# EasyEDA Pro project 2025_09_11_usb2spi.epro

# Board PCB1
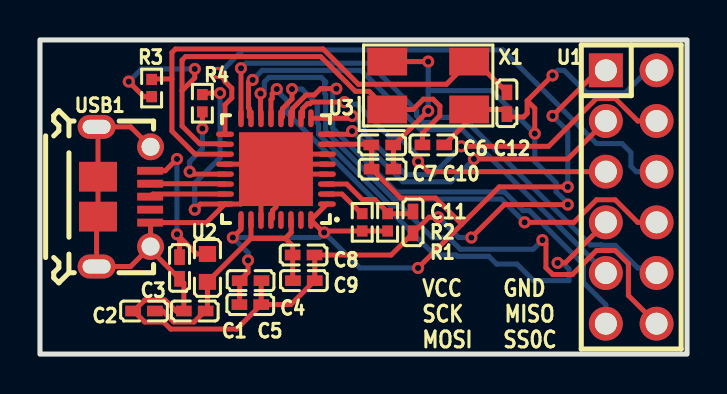
[diagram p0: board, top side]
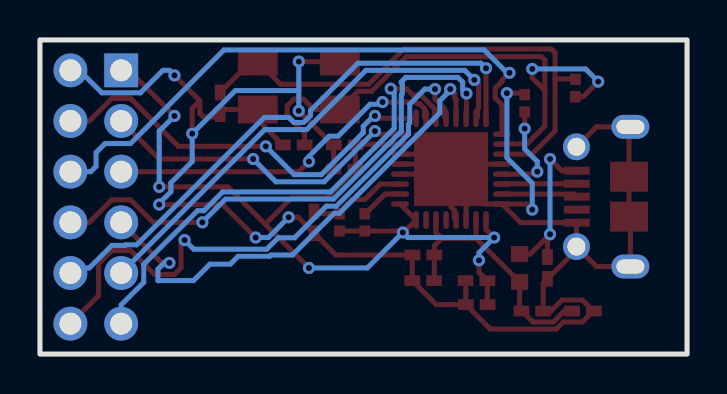
[diagram p1: board, bottom side, seen from below]

Outline 32.38 x 15.75 mm; copper layers: Top Layer, Bottom Layer. Coordinates in mm from the lower left corner of the outline.
Outline path: rectangle 0,15.75 32.38,0
Stack: Top Layer 0.035mm / Dielectric1 1.51mm FR4 er 4.5 / Bottom Layer 0.035mm

## Design rules (mm)
template: JLCPCB Capability(Two Layers Board)
spacing copperThickness1oz (default): track to track 0.102, other pairs 0.152 to 0.3
spacing copperThickness2oz: track to track 0.203, other pairs 0.152 to 0.3
track width copperThickness1oz (default): min 0.127, default 0.254, max 2.54
track width copperThickness2oz: min 0.203, default 0.254, max 2.54
differential pair differentialPair (default): width min 0.127, default 0.254, max 2.54; gap min 0.152, default 0.152
via viaSize (default): diameter min 0.5, default 0.61, max 10; hole min 0.3, default 0.305, max 6.3

## Placement (name value [footprint] x y rotation side)
C1  100nF  [C0402]  7.75 2.16 180 top
C2  4.7uF  [C0402]  5.21 2.16 0 top
C3  10nF  [C0402]  6.99 4.32 90 top
C4  100nF  [C0402]  10.54 3.68 0 top
C5  4.7uF  [C0402]  10.53 2.48 180 top
C6  100nF  [C0402]  17.13 10.48 0 top
C7  4.7uF  [C0402]  17.15 9.27 180 top
C8  100nF  [C0402]  13.19 4.97 0 top
C9  4.7uF  [C0402]  13.21 3.68 180 top
C10  30pF  [C0402]  19.69 10.48 180 top
C11  470nF  [C0402]  18.67 6.6 90 top
C12  30pF  [C0402]  23.37 12.57 90 top
R1  10kΩ  [R0402]  16.13 6.6 90 top
R2  47kΩ  [R0402]  17.4 6.6 90 top
R3  1MΩ  [R0402]  5.59 13.34 90 top
R4  12kΩ  [R0402]  8.13 12.57 270 top
U1  ZX-PZ2.54-2-6PZZ  [HDR-TH_12P-P2.54-V-M-R2-C6-S2.54]  29.59 7.87 270 top
U2  CBW160808U400T  [L0603]  8.38 4.32 270 top
U3  FT4222HQ-D-T  [QFN-32_L5.0-W5.0-P0.50-BL-EP3.7]  11.81 9.27 90 top
USB1  1050170001  [MICRO-USB-SMD_105017-0001]  4.19 7.89 270 top
X1  12MHz  [OSC-SMD_4P-L5.0-W3.2-BL]  19.43 13.46 0 top

## Footprints (pads in the part's own frame, mm; a bottom-side part is the same pattern mirrored in y, then rotated)
C0402
  rect 0.79x0.54 smd: 1(-0.545,0) 2(0.545,0)
HDR-TH_12P-P2.54-V-M-R2-C6-S2.54
  rect 1.7x1.7 hole 1.1: 1(-6.35,-1.27)
  round 1.7 hole 1.1: 2(-6.35,1.27) 3(-3.81,-1.27) 4(-3.81,1.27) 5(-1.27,-1.27) 6(-1.27,1.27) 7(1.27,-1.27) 8(1.27,1.27) 9(3.81,-1.27) 10(3.81,1.27) 11(6.35,-1.27) 12(6.35,1.27)
L0603
  rect 0.8x0.864 smd: 1(-0.7,0) 2(0.7,0)
MICRO-USB-SMD_105017-0001
  rect 0.4x1.3 smd: 1(-1.3,1.33) 2(-0.65,1.33) 3(0,1.33) 4(0.65,1.33) 5(1.3,1.33)
  round 1.35 hole 0.9: 6(-2.5,1.35) 7(2.5,1.35)
  oval 1.2x1.9 hole 0.7x1.4: 8(3.5,-1.35) 9(-3.5,-1.35)
  rect 1.5x1.9 smd: 10(-1,-1.28) 10(1,-1.28)
OSC-SMD_4P-L5.0-W3.2-BL
  rect 2x1.4 smd: 1(-2.05,-1.2) 2(2.05,-1.2) 3(2.05,1.2) 4(-2.05,1.2)
QFN-32_L5.0-W5.0-P0.50-BL-EP3.7
  oval 0.28x0.9 smd: 1(-1.75,-2.55) 2(-1.25,-2.55) 3(-0.75,-2.55) 4(-0.25,-2.55) 5(0.25,-2.55) 6(0.75,-2.55) 7(1.25,-2.55) 8(1.75,-2.55) 17(1.75,2.55) 18(1.25,2.55) 19(0.75,2.55) 20(0.25,2.55) 21(-0.25,2.55) 22(-0.75,2.55) 23(-1.25,2.55) 24(-1.75,2.55)
  oval 0.9x0.28 smd: 9(2.55,-1.75) 10(2.55,-1.25) 11(2.55,-0.75) 12(2.55,-0.25) 13(2.55,0.25) 14(2.55,0.75) 15(2.55,1.25) 16(2.55,1.75) 25(-2.55,1.75) 26(-2.55,1.25) 27(-2.55,0.75) 28(-2.55,0.25) 29(-2.55,-0.25) 30(-2.55,-0.75) 31(-2.55,-1.25) 32(-2.55,-1.75)
  rect 3.7x3.7 smd: 33(0,0)
R0402
  rect 0.566x0.54 smd: 1(-0.433,0) 2(0.433,0)

## Nets
+5V: C1.1 C2.2 C8.1 C9.2 U2.2 U3.26 U3.30
GND: C1.2 C2.1 C3.1 C4.2 C5.1 C6.2 C7.1 C8.2 C9.1 C10.1 C11.1 C12.1 R4.1 U1.2 U3.4 U3.5 U3.6 U3.20 U3.24 U3.27 U3.28 U3.33 USB1.5 USB1.6 USB1.7 USB1.8 USB1.9 USB1.10 X1.2 X1.4
VCC: C4.1 C5.2 C6.1 C7.2 R1.1 R2.1 U1.1 U3.1 U3.7 U3.25 U3.32
DN: U3.22 USB1.2
DP: U3.23 USB1.3
GPIO0: U1.7 U3.13
GPIO1: U1.8 U3.14
GPIO2: U1.9 U3.15
GPIO3: U1.10 U3.16
IO2: U1.11 U3.11
IO3: U1.12 U3.12
MISO: U1.4 U3.9
MOSI: U1.5 U3.10
RESETN: C11.2 R2.2 U3.3
SCK: U1.3 U3.8
SS0C: U1.6 U3.17
STEST_RSTN: R1.2 U3.2
XSCI: C10.2 R3.1 U3.18 X1.1
XSCO: C12.2 R3.2 U3.19 X1.3
$1N566: R4.2 U3.21
$1N1266: C3.2 U2.1 USB1.1

Pads without a net: U3 29 31; USB1 4

## Via types
v1: diameter 0.61, hole 0.305, Top Layer to Bottom Layer, 37 vias

## Routing (per net, layer and track width the routed paths; a pad name or vN(x,y) marks a point on that pad's centre or on a via; arc(x,y) is an arc through that point)
+5V: length 13.5
  Top Layer w0.254: C9.2 12.65,3.7 C8.1 12.65,5.42 12.27,5.8 ; 12.27,5.8 10.56,5.8 ; 12.27,5.8 12.57,6.1 12.57,6.71 U3.30 ; 10.56,5.8 U2.2 8.38,2.25 C1.1 8.26,2.16 7.71,1.61 6.69,1.61 6.14,2.16 C2.2 ; 10.56,5.8 U3.26
GND: length 113.3
  Top Layer w0.254: USB1.7 4.53,4.39 USB1.8 2.84,6.82 USB1.10 USB1.10 2.91,11.32 USB1.9 4.53,11.39 USB1.6 ; USB1.7 5.53,6.57 USB1.5 8.33,6.59 U3.24 ; USB1.7 5.53,5.22 C3.1 7.2,3.56 C1.2 6.81,2.16 6.26,2.71 5.24,2.71 4.69,2.16 ; v1(19.94,6.86) 19.47,6.86 C11.1 17.58,4.97 C8.2 13.75,4.95 C9.1 12.55,2.48 C5.1 ; v1(26.42,7.49) 23.24,7.49 v1(21.59,5.84) ; 4.69,2.16 5.24,1.61 6.19,1.61 6.54,1.25 9.84,1.25 C5.1 ; 4.69,2.16 C2.1 ; 14.36,9.02 12.06,9.02 U3.33 ; C4.2 11.07,3.67 C5.1 ; U3.20 11.56,9.52 U3.33 ; X1.4 v1(19.43,14.66) ; U3.24 8.03,7.52 v1(7.75,7.24) ; U3.24 10.06,7.52 11.06,8.52 U3.27 ; U3.33 11.81,7.37 11.64,7.2 11.64,6.8 U3.28 ; v1(19.43,12.19) 17.72,10.48 17.68,10.48 17.69,10.47 C7.1 ; 14.36,10.02 12.56,10.02 12.06,9.52 14.36,9.52 ; v1(9.02,13.08) 8.2,13.08 R4.1 ; C10.1 21.48,11.74 21.48,12.26 23.13,12.26 C12.1 23.51,11.89 24.2,11.89 24.38,12.06 24.38,12.7 ; v1(24.76,11.05) 24.76,12.32 24.38,12.7 ; 24.38,12.7 v1(25.65,13.97)
  Bottom Layer w0.254: v1(9.02,13.08) 9.02,9.84 7.75,8.57 v1(7.75,7.24) ; v1(21.59,5.84) 20.96,5.84 v1(19.94,6.86) ; 19.43,13.21 v1(19.43,12.19) ; 19.43,13.21 22.61,13.21 v1(24.76,11.05) 24.76,9.65 25.83,8.59 25.83,8.14 26.42,7.56 v1(26.42,7.49) ; 19.43,13.21 v1(19.43,14.66) ; 30.86,14.22 30.42,14.22 29.29,13.09 27.36,13.09 26.23,14.22 25.91,14.22 v1(25.65,13.97)
VCC: length 46.1
  Top Layer w0.254: 21.1,6.5 21.1,6.52 19.8,7.82 18.05,7.82 C7.2 16.6,10.47 C6.1 16.55,10.52 14.36,10.52 ; 21.1,6.5 v1(18.92,4.32) ; 21.1,6.5 22.99,8.38 v1(26.42,8.38) ; 9.98,2.48 10,2.5 C4.1 10.41,4.1 v1(10.41,4.7) ; U3.25 10.06,6.25 v1(9.65,5.84) ; 17.4,6.17 14.3,6.17 v1(14.22,6.1) 14.19,6.1 U3.32 14.36,7.52 ; v1(25.65,11.94) 27.94,14.22 U1.1
  Bottom Layer w0.254: v1(10.41,4.7) 10.41,5.08 v1(9.65,5.84) 13.97,5.84 v1(14.22,6.1) 16,4.32 v1(18.92,4.32) ; v1(25.65,11.94) 26.42,11.18 v1(26.42,8.38)
DN: length 3.8
  Top Layer w0.254: USB1.2 9.24,8.54 U3.22
DP: length 3.8
  Top Layer w0.254: U3.23 5.65,8.02 USB1.3
GPIO0: length 25.2
  Top Layer w0.254: v1(11.85,13.28) 11.62,13.06 11.62,12.82 11.56,12.76 U3.13 ; U1.7 26.29,4.57 v1(25.91,4.57)
  Bottom Layer w0.254: v1(25.91,4.57) 25.97,4.64 26.1,4.64 26.48,4.25 26.48,3.68 24.7,3.68 23.88,4.51 22.86,4.51 22.47,4.9 20.89,4.9 20.82,4.97 19.75,4.97 17.65,7.06 17.4,7.06 12.37,12.09 12.37,12.7 12.03,13.04 12.03,13.11 v1(11.85,13.28)
GPIO1: length 27.1
  Top Layer w0.254: v1(11.04,13.06) 11.04,11.84 U3.14 ; 30.86,6.6 29.92,6.6 28.79,7.73 27.85,7.73 26.72,6.6 v1(24.26,6.6)
  Bottom Layer w0.254: v1(24.26,6.6) 24.26,6.61 23.09,7.77 17.7,7.77 14.3,11.17 14.3,13.01 14.25,13.06 14.25,13.54 14.3,13.6 14.3,13.64 14.08,13.87 11.46,13.87 11.23,13.63 11.23,13.25 v1(11.04,13.06)
GPIO2: length 24.2
  Top Layer w0.254: v1(10.65,13.74) 10.55,13.74 10.43,13.63 10.43,12.35 10.48,12.3 10.48,11.9 U3.15
  Bottom Layer w0.254: U1.9 21.13,11.25 19.04,11.25 16.07,14.22 11.13,14.22 v1(10.65,13.74)
GPIO3: length 28.1
  Top Layer w0.254: U3.16 v1(10.06,14.33)
  Bottom Layer w0.254: v1(10.06,14.33) 10.31,14.58 16.47,14.58 18.85,12.2 18.85,11.95 19.19,11.61 19.67,11.61 19.93,11.86 21.16,11.86 27.54,5.48 28.11,5.48 28.14,5.45 28.79,5.45 29.92,4.32 30.61,4.32 30.86,4.06
IO2: length 24
  Top Layer w0.254: v1(14.83,13.3) 14.04,13.3 13.73,12.99 13.32,12.99 12.64,12.31 12.64,11.9 U3.11
  Bottom Layer w0.254: U1.11 28.32,2.47 27.19,3.6 27.19,4.5 24.5,7.19 24.18,7.19 23.24,8.13 17.84,8.13 14.66,11.31 14.66,13.13 v1(14.83,13.3)
IO3: length 28.7
  Top Layer w0.254: 30.86,1.52 29.45,2.94 29.45,4.53 28.79,5.19 27.85,5.19 26.65,3.99 25.67,3.99 25.32,4.33 25.32,5.54 v1(25.15,5.72) ; v1(12.61,13.28) 12.61,12.78 12.14,12.31 12.14,11.9 U3.12
  Bottom Layer w0.254: v1(25.15,5.72) 24.69,5.26 21.04,5.26 20.47,5.83 19.64,5.83 18.05,7.42 17.55,7.42 13.94,11.02 13.94,11.53 13.88,11.59 13.88,12.52 13.12,13.28 v1(12.61,13.28)
MISO: length 20.8
  Top Layer w0.254: 30.86,11.68 29.92,11.68 28.79,12.81 27.85,12.81 25.45,10.41 v1(21.08,10.41) ; v1(15.62,11.94) 15.5,11.82 U3.9
  Bottom Layer w0.254: v1(21.08,10.41) 19.66,8.99 18.31,8.99 16.21,11.1 16.21,11.42 15.69,11.94 v1(15.62,11.94)
MOSI: length 17.4
  Top Layer w0.254: v1(18.92,9.65) 19.43,9.14 U1.5 ; v1(15.24,12.63) 13.6,12.63 13.51,12.55 13.39,12.55 13.14,12.3 13.14,11.9 U3.10
  Bottom Layer w0.254: v1(18.92,9.65) 18.92,9.91 17.91,10.92 17.46,10.92 15.86,12.52 15.35,12.52 v1(15.24,12.63)
RESETN: length 5
  Top Layer w0.254: C11.2 18.56,7.04 R2.2 17.4,7.11 16.76,7.75 16.13,7.75 15.35,8.52 14.36,8.52
SCK: length 16.3
  Top Layer w0.254: 14.36,11.02 15.47,11.02 v1(15.62,11.18) ; v1(21.72,9.78) 26.42,9.78 U1.3
  Bottom Layer w0.254: v1(15.62,11.18) 18.16,8.64 20.57,8.64 v1(21.72,9.78)
SS0C: length 28.9
  Top Layer w0.254: U3.17 9.26,12.5 9.6,12.84 9.6,13.32 9.26,13.66 9.26,13.73 v1(8.89,14.1)
  Bottom Layer w0.254: 30.86,9.14 29.84,9.14 29.58,9.41 29.58,10.1 29.12,10.56 27.85,10.56 26.24,12.17 26.24,12.18 23.17,15.25 10.15,15.25 9,14.1 v1(8.89,14.1)
STEST_RSTN: length 2.2
  Top Layer w0.254: R1.2 16.1,7.04 15.11,8.02 14.36,8.02
XSCI: length 28.9
  Top Layer w0.254: 7.11,13.21 7.11,14.73 7.29,14.91 14.05,14.91 15.79,13.17 16.47,13.17 X1.1 18.68,12.26 19.19,12.78 19.67,12.78 20.01,12.43 20.01,11.95 19.14,11.08 C10.2 ; 7.11,13.21 7.75,13.84 v1(7.75,14.29) ; 7.11,13.21 7.11,11.43 8,10.54 9.24,10.54 U3.18 ; R3.1 5.2,12.9 v1(4.44,13.66)
  Bottom Layer w0.254: v1(7.75,14.29) 5.08,14.29 v1(4.44,13.66)
XSCO: length 26.8
  Top Layer w0.254: 6.6,13.79 6.6,15.11 6.78,15.29 14.17,15.29 15.94,13.53 20.34,13.53 21.48,14.66 21.82,14.66 C12.2 ; 6.6,13.79 5.61,13.79 R3.2 ; 6.6,13.79 6.6,11.18 7.76,10.02 U3.19
$1N566: length 5
  Top Layer w0.254: v1(7.49,9.14) 7.62,9.02 U3.21 ; 8.13,12.01 v1(8.13,11.3)
  Bottom Layer w0.254: v1(8.13,11.3) 8.13,10.29 7.49,9.65 v1(7.49,9.14)
$1N1266: length 8.2
  Top Layer w0.254: 6.99,5.88 7.85,5.02 U2.1 ; 6.99,5.88 C3.2 ; 6.99,5.88 v1(6.86,6.01) ; v1(6.86,9.78) 6.27,9.19 USB1.1
  Bottom Layer w0.254: v1(6.86,9.78) 6.86,6.1

## Text on the board
Top Silkscreen Layer: VCC    GND / SCK    MISO / MOSI   SS0C
